# EasyEDA Pro project ProPrj_cap banks_2026-02-15.epro, schematic Schematic1
Board Name: Board1; Create Date: 2025-07-01; Page Name: P1; Project Name: cap bank; Schematic Name: Schematic1; Update Date: 2025-08-10; Company: EasyEDA.com; Page Size: A4; Version: V1.0
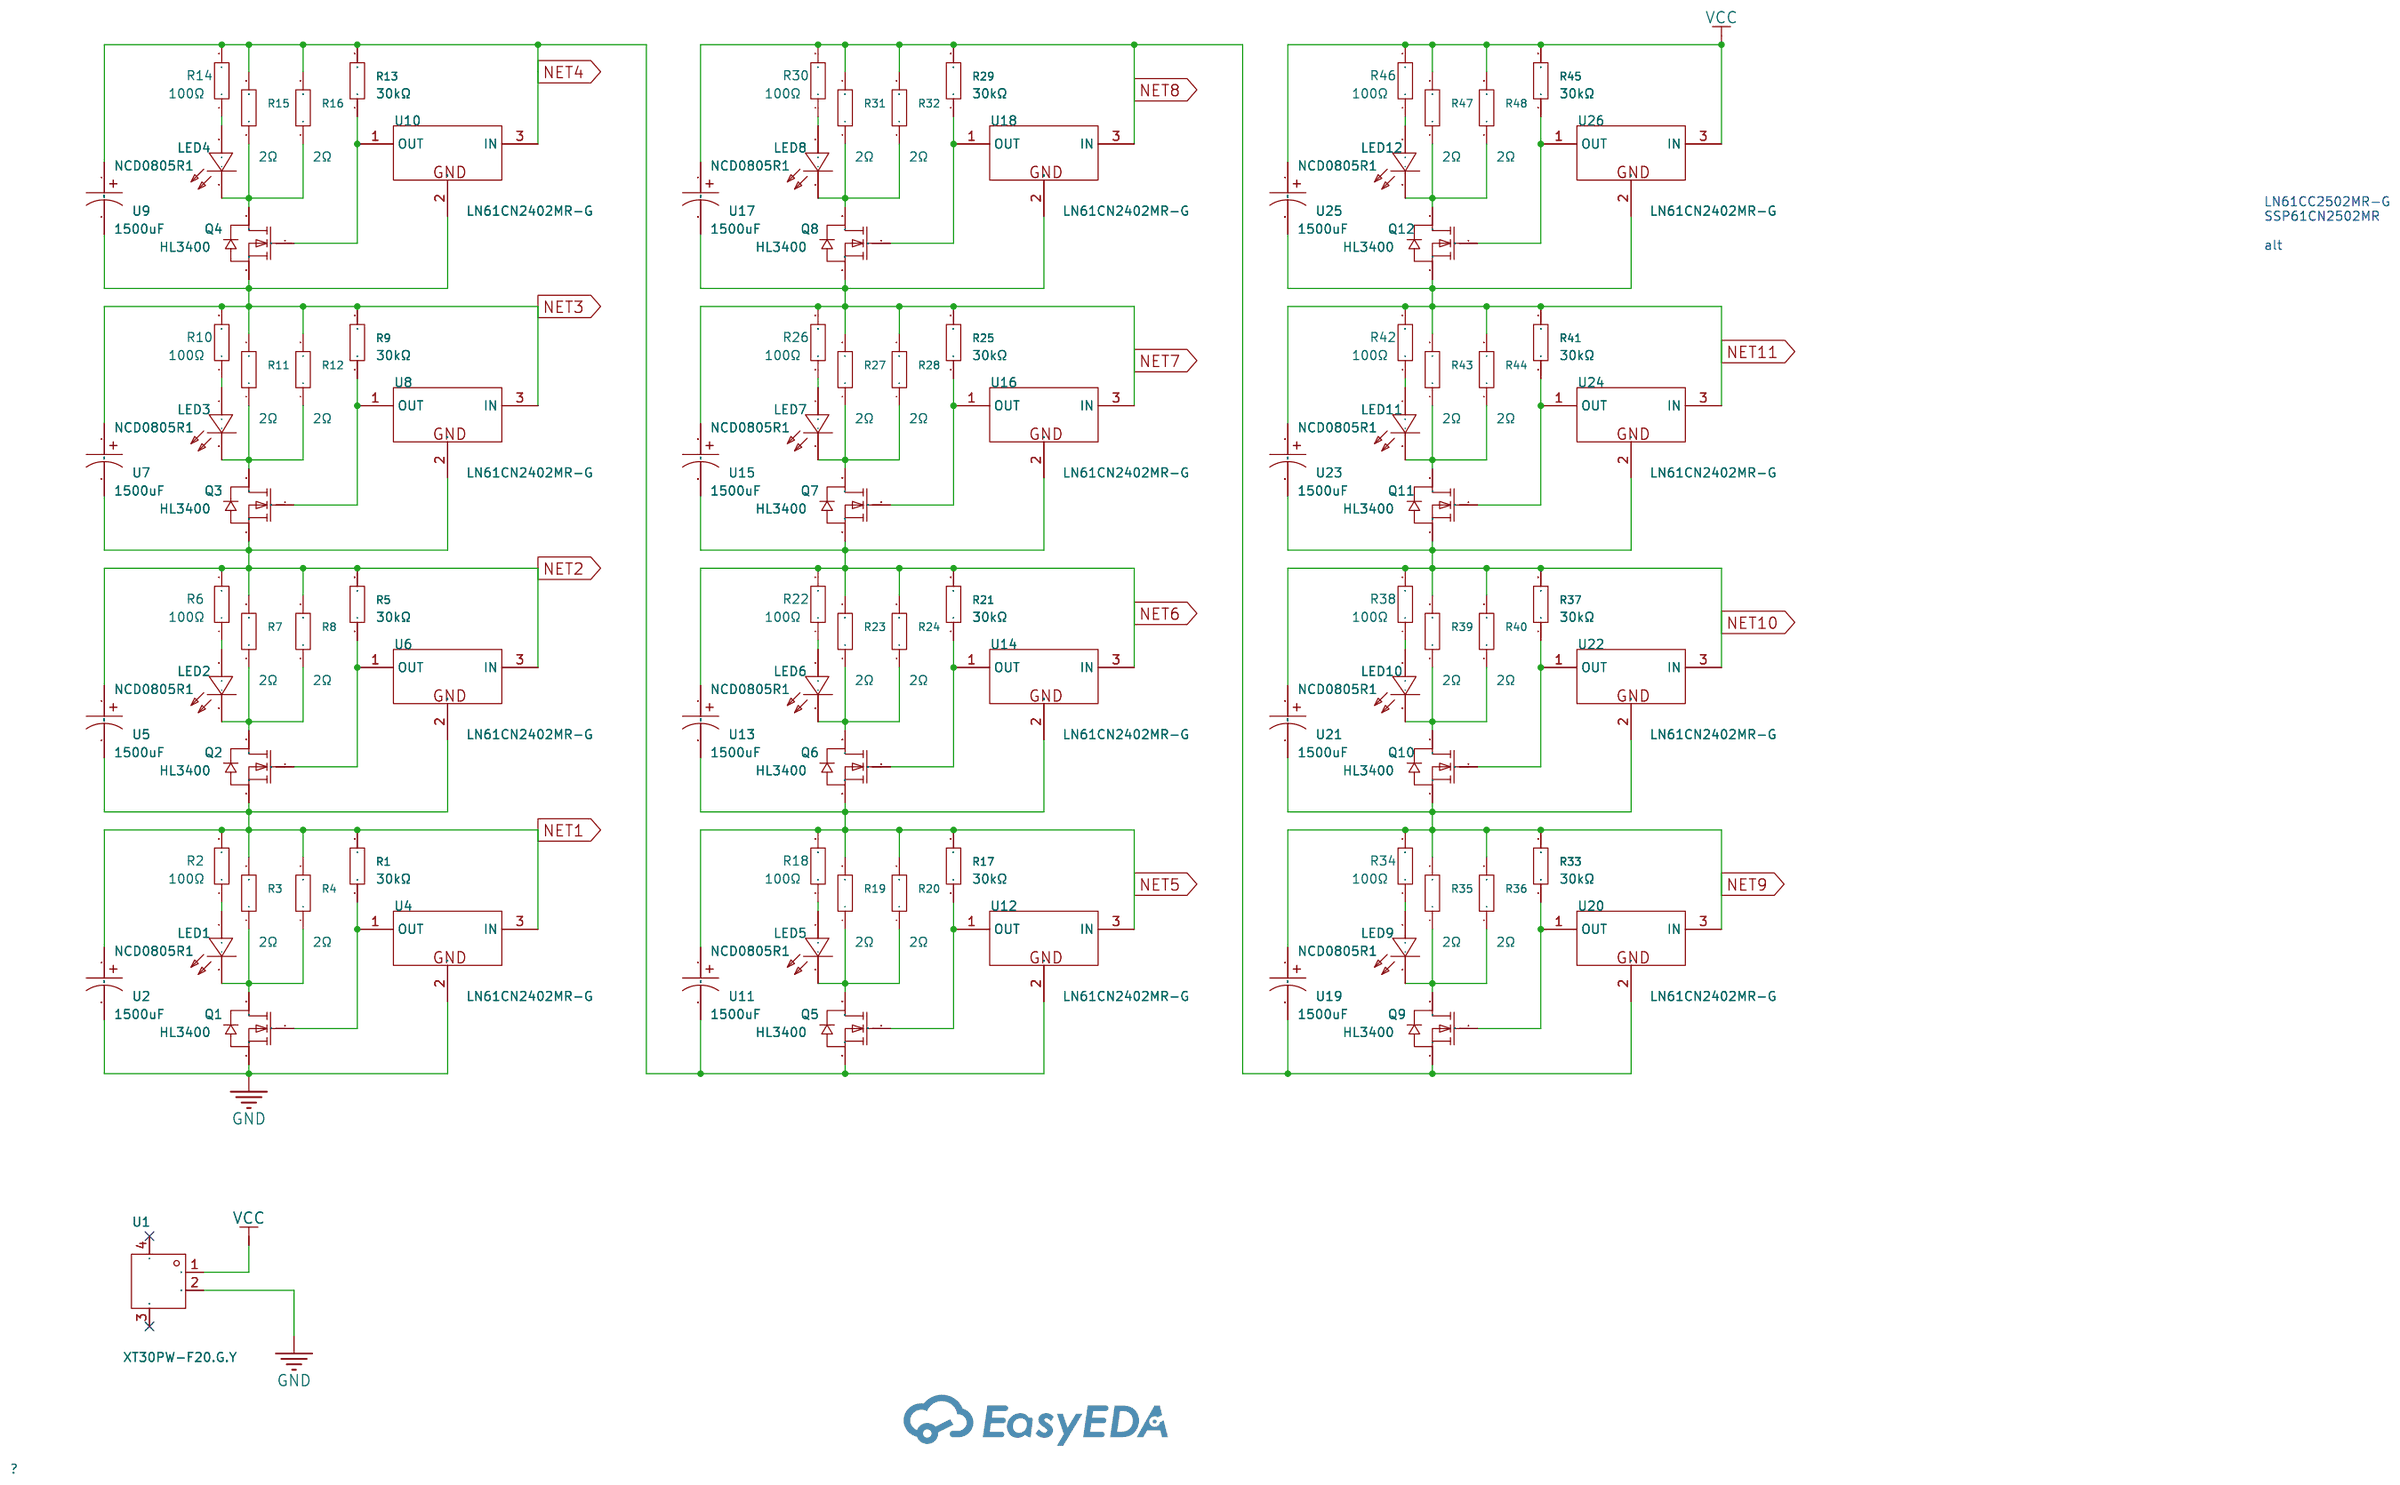
[diagram p0: schematic sheet]

## Parts
LED1  NCD0805R1  [LED0805-R-RD]
LED2  NCD0805R1  [LED0805-R-RD]
LED3  NCD0805R1  [LED0805-R-RD]
LED4  NCD0805R1  [LED0805-R-RD]
LED5  NCD0805R1  [LED0805-R-RD]
LED6  NCD0805R1  [LED0805-R-RD]
LED7  NCD0805R1  [LED0805-R-RD]
LED8  NCD0805R1  [LED0805-R-RD]
LED9  NCD0805R1  [LED0805-R-RD]
LED10  NCD0805R1  [LED0805-R-RD]
LED11  NCD0805R1  [LED0805-R-RD]
LED12  NCD0805R1  [LED0805-R-RD]
Q1  HL3400  [SOT-23-3_L2.9-W1.3-P1.90-LS2.4-BR]
Q2  HL3400  [SOT-23-3_L2.9-W1.3-P1.90-LS2.4-BR]
Q3  HL3400  [SOT-23-3_L2.9-W1.3-P1.90-LS2.4-BR]
Q4  HL3400  [SOT-23-3_L2.9-W1.3-P1.90-LS2.4-BR]
Q5  HL3400  [SOT-23-3_L2.9-W1.3-P1.90-LS2.4-BR]
Q6  HL3400  [SOT-23-3_L2.9-W1.3-P1.90-LS2.4-BR]
Q7  HL3400  [SOT-23-3_L2.9-W1.3-P1.90-LS2.4-BR]
Q8  HL3400  [SOT-23-3_L2.9-W1.3-P1.90-LS2.4-BR]
Q9  HL3400  [SOT-23-3_L2.9-W1.3-P1.90-LS2.4-BR]
Q10  HL3400  [SOT-23-3_L2.9-W1.3-P1.90-LS2.4-BR]
Q11  HL3400  [SOT-23-3_L2.9-W1.3-P1.90-LS2.4-BR]
Q12  HL3400  [SOT-23-3_L2.9-W1.3-P1.90-LS2.4-BR]
R1  30kΩ  [R0805]
R2  100Ω  [R0805]
R3  2Ω  [R2512]
R4  2Ω  [R2512]
R5  30kΩ  [R0805]
R6  100Ω  [R0805]
R7  2Ω  [R2512]
R8  2Ω  [R2512]
R9  30kΩ  [R0805]
R10  100Ω  [R0805]
R11  2Ω  [R2512]
R12  2Ω  [R2512]
R13  30kΩ  [R0805]
R14  100Ω  [R0805]
R15  2Ω  [R2512]
R16  2Ω  [R2512]
R17  30kΩ  [R0805]
R18  100Ω  [R0805]
R19  2Ω  [R2512]
R20  2Ω  [R2512]
R21  30kΩ  [R0805]
R22  100Ω  [R0805]
R23  2Ω  [R2512]
R24  2Ω  [R2512]
R25  30kΩ  [R0805]
R26  100Ω  [R0805]
R27  2Ω  [R2512]
R28  2Ω  [R2512]
R29  30kΩ  [R0805]
R30  100Ω  [R0805]
R31  2Ω  [R2512]
R32  2Ω  [R2512]
R33  30kΩ  [R0805]
R34  100Ω  [R0805]
R35  2Ω  [R2512]
R36  2Ω  [R2512]
R37  30kΩ  [R0805]
R38  100Ω  [R0805]
R39  2Ω  [R2512]
R40  2Ω  [R2512]
R41  30kΩ  [R0805]
R42  100Ω  [R0805]
R43  2Ω  [R2512]
R44  2Ω  [R2512]
R45  30kΩ  [R0805]
R46  100Ω  [R0805]
R47  2Ω  [R2512]
R48  2Ω  [R2512]
U1  XT30PW-F20.G.Y  [CONN-TH_XT30PW-F-1]
U2  1500uF  [CAP-TH_BD18.0-P7.50-D0.8-FD]
U4  LN61CN2402MR-G  [SOT-23_L2.9-W1.3-P1.90-LS2.4-BR]
U5  1500uF  [CAP-TH_BD18.0-P7.50-D0.8-FD]
U6  LN61CN2402MR-G  [SOT-23_L2.9-W1.3-P1.90-LS2.4-BR]
U7  1500uF  [CAP-TH_BD18.0-P7.50-D0.8-FD]
U8  LN61CN2402MR-G  [SOT-23_L2.9-W1.3-P1.90-LS2.4-BR]
U9  1500uF  [CAP-TH_BD18.0-P7.50-D0.8-FD]
U10  LN61CN2402MR-G  [SOT-23_L2.9-W1.3-P1.90-LS2.4-BR]
U11  1500uF  [CAP-TH_BD18.0-P7.50-D0.8-FD]
U12  LN61CN2402MR-G  [SOT-23_L2.9-W1.3-P1.90-LS2.4-BR]
U13  1500uF  [CAP-TH_BD18.0-P7.50-D0.8-FD]
U14  LN61CN2402MR-G  [SOT-23_L2.9-W1.3-P1.90-LS2.4-BR]
U15  1500uF  [CAP-TH_BD18.0-P7.50-D0.8-FD]
U16  LN61CN2402MR-G  [SOT-23_L2.9-W1.3-P1.90-LS2.4-BR]
U17  1500uF  [CAP-TH_BD18.0-P7.50-D0.8-FD]
U18  LN61CN2402MR-G  [SOT-23_L2.9-W1.3-P1.90-LS2.4-BR]
U19  1500uF  [CAP-TH_BD18.0-P7.50-D0.8-FD]
U20  LN61CN2402MR-G  [SOT-23_L2.9-W1.3-P1.90-LS2.4-BR]
U21  1500uF  [CAP-TH_BD18.0-P7.50-D0.8-FD]
U22  LN61CN2402MR-G  [SOT-23_L2.9-W1.3-P1.90-LS2.4-BR]
U23  1500uF  [CAP-TH_BD18.0-P7.50-D0.8-FD]
U24  LN61CN2402MR-G  [SOT-23_L2.9-W1.3-P1.90-LS2.4-BR]
U25  1500uF  [CAP-TH_BD18.0-P7.50-D0.8-FD]
U26  LN61CN2402MR-G  [SOT-23_L2.9-W1.3-P1.90-LS2.4-BR]

## Library data of the parts
LED1-LED12 = NCD0805R1_C84256: Lamp Holder Type:- Emitted Color:Red Forward Voltage (VF):1.6V~2.6V Forward Voltage (VF):1.6V~2.6V Power Dissipation:65mW Forward Current:20mA Dominant Wavelength:615nm~630nm Dominant Wavelength:615nm~630nm Peak Wavelength:- Diode Configuration:独立二极管 Lens; Supplier Part: C84256; Manufacturer: 国星光电; Supplier Footprint: 0805; JLCPCB Part Class: Basic Part; Datasheet: https://atta.szlcsc.com/upload/public/pdf/source/20200820/C84256_F0A75A43B3EAD75808600A0514C76B99.pdf; Supplier: LCSC; Emitted Color: Red; Forward Voltage (VF): 1.6V~2.6V; Power Dissipation: 65mW; Forward Current: 20mA; Dominant Wavelength: 615nm~630nm; Diode Configuration: 独立二极管; Lens Color: 无色透明透镜; Luminous Intensity: 67mcd~195mcd; Viewing Angle: 130°; Operating Temperature: -30℃~+85℃
Q1-Q12 = HL3400: Type:1 N-channel Drain to Source Voltage:30V Current - Continuous Drain(Id):5.6A RDS(on):33mΩ@4.5V,5A Pd - Power Dissipation:1.2W Gate Threshold Voltage (Vgs(th)@Id):1.5V Gate Charge(Qg):17nC@4.5V Input Capacitance(Ciss@Vds):630pF@15V Reverse Transfer Cap; LCSC Part Name: N-通道,电流:5.6A,耐压:30V; Supplier Part: C22469448; Manufacturer: 宏嘉诚; Supplier Footprint: SOT-23; JLCPCB Part Class: Extended Part; Datasheet: https://atta.szlcsc.com/upload/public/pdf/source/20250106/821A5FA5B3A156C0B96C3BD3FAAD026C.pdf; Supplier: LCSC; Type: 1 N-channel; Drain to Source Voltage: 30V; Current - Continuous Drain(Id): 5.6A; RDS(on): 33mΩ@4.5V,5A; Pd - Power Dissipation: 1.2W; Gate Threshold Voltage (Vgs(th)@Id): 1.5V; Gate Charge(Qg): 17nC@4.5V; Input Capacitance(Ciss@Vds): 630pF@15V; Reverse Transfer Capacitance (Crss@Vds): 71pF@15V; Operating Temperature: -55℃~+150℃
R1 R5 R9 R13 R17 R21 R25 R29 R33 R37 R41 R45 = 0805W8F3002T5E: Type:Thick Film Resistors Resistance:30kΩ Tolerance:±1% Tolerance:±1% Power(Watts): Overload Voltage (Max): Temperature Coefficient:±100ppm/℃ Temperature Coefficient:±100ppm/℃ Operating Temperature Range:-55℃~+155℃ Operating Temperature Range:-55℃~+155℃; LCSC Part Name: 30kΩ ±1% 125mW 厚膜电阻; Supplier Part: C17621; Manufacturer: UNI-ROYAL(厚声); Supplier Footprint: 0805; JLCPCB Part Class: Basic Part; Datasheet: https://atta.szlcsc.com/upload/public/pdf/source/20200306/C422600_1E6D84923E4A46A82E41ADD87F860B5C.pdf; Supplier: LCSC; Type: Thick Film Resistors; Tolerance: ±1%; Temperature Coefficient: ±100ppm/℃; Operating Temperature Range: -55℃~+155℃
R2 R6 R10 R14 R18 R22 R26 R30 R34 R38 R42 R46 = 0805W8F1000T5E_C17408: Type:Thick Film Resistors Resistance: Tolerance:±1% Tolerance:±1% Power(Watts): Overload Voltage (Max): Temperature Coefficient:±100ppm/℃ Temperature Coefficient:±100ppm/℃ Operating Temperature Range:-55℃~+155℃ Operating Temperature Range:-55℃~+155℃; LCSC Part Name: 100Ω ±1% 125mW 厚膜电阻; Supplier Part: C17408; Manufacturer: UNI-ROYAL(厚声); Manufacturer Part: 0805W8F1000T5E; Supplier Footprint: 0805; JLCPCB Part Class: Basic Part; Datasheet: https://atta.szlcsc.com/upload/public/pdf/source/20200306/C422600_1E6D84923E4A46A82E41ADD87F860B5C.pdf; Supplier: LCSC; Type: Thick Film Resistors; Tolerance: ±1%; Temperature Coefficient: ±100ppm/℃; Operating Temperature Range: -55℃~+155℃
R3 R4 R7 R8 R11 R12 R15 R16 R19 R20 R23 R24 R27 R28 R31 R32 R35 R36 R39 R40 R43 R44 R47 R48 = FRC2512J2R0TS: Type:Thick Film Resistors Resistance:2Ω Tolerance:±5% Tolerance:±5% Power(Watts):1W Voltage-Supply(Max):200V Temperature Coefficient:±200ppm/℃ Temperature Coefficient:±200ppm/℃; LCSC Part Name: 2Ω ±5% 1W 厚膜电阻; Supplier Part: C3000637; Manufacturer: FOJAN(富捷); Supplier Footprint: 2512; JLCPCB Part Class: Extended Part; Datasheet: https://atta.szlcsc.com/upload/public/pdf/source/20211221/925EC7D7225764EE0046F22065062C87.pdf; Supplier: LCSC; Type: Thick Film Resistors; Tolerance: ±5%; Power(Watts): 1W; Voltage-Supply(Max): 200V; Temperature Coefficient: ±200ppm/℃
U1 = XT30PW-F20.G.Y: Power:- Output:- Input:- Size:- Interface:- Type:- Colour:- MaximumCurrent:- Type:航模插头 RatedVoltage:- Type1:- NumberOfUSBHoles:- InterfaceType:母头 MetalMaterial:- InsulationMaterial:- RatedCurrent:- RecommendedWireGauge:- FlameRetardantGrade:- contact resi; LCSC Part Name: AMASS(艾迈斯)电源连接器 母头 XT30PW-F; Supplier Part: C2913282; Manufacturer: AMASS(艾迈斯); JLCPCB Part Class: Extended Part; Datasheet: https://atta.szlcsc.com/upload/public/pdf/source/20231218/06CFCF98887A9A87638B0856A725C8FD.pdf; Supplier: LCSC; Type: 航模插头; InterfaceType: 母头
U2 U5 U7 U9 U11 U13 U15 U17 U19 U21 U23 U25 = 80ZLH1500MEFC18X40: Capacitance: Tolerance:±20% Tolerance:±20% Rated Voltage: Ripple Current:- Equivalent Series Resistance(ESR):- Lead Spacing:7.5mm φD: L: Lifetime @ Temp:- Operating Temperature:-40℃~+105℃ Operating Temperature:-40℃~+105℃; LCSC Part Name: 1500uF ±20% 80V; Supplier Part: C700879; Manufacturer: rubycon(红宝石); Supplier Footprint: 插件,D18xL40mm; JLCPCB Part Class: Extended Part; Datasheet: https://atta.szlcsc.com/upload/public/pdf/source/20200710/C700879_22A88F1D2FB7159B35BD93EA845084AE.pdf; Supplier: LCSC; Tolerance: ±20%; Lead Spacing: 7.5mm; Operating Temperature: -40℃~+105℃
U4 U6 U8 U10 U12 U14 U16 U18 U20 U22 U24 U26 = LN61CN2402MR-G: Supplier Part: C141418; Manufacturer: natlinear(南麟); Supplier Footprint: SOT-23; JLCPCB Part Class: Extended Part; Datasheet: https://atta.szlcsc.com/upload/public/pdf/source/20171110/C141418_15102792347801104211.pdf; Supplier: LCSC

## Nets
GND: Q1.2(S) U1.2 U2.2 U4.2(GND)
VCC: R45.2 R46.2 R47.2 R48.2 U1.1 U25.1 U26.3(IN)
NET1: Q2.2(S) R1.2 R2.2 R3.2 R4.2 U2.1 U4.3(IN) U5.2 U6.2(GND)
NET2: Q3.2(S) R5.2 R6.2 R7.2 R8.2 U5.1 U6.3(IN) U7.2 U8.2(GND)
NET3: Q4.2(S) R9.2 R10.2 R11.2 R12.2 U7.1 U8.3(IN) U9.2 U10.2(GND)
NET4: Q5.2(S) R13.2 R14.2 R15.2 R16.2 U9.1 U10.3(IN) U11.2 U12.2(GND)
NET5: Q6.2(S) R17.2 R18.2 R19.2 R20.2 U11.1 U12.3(IN) U13.2 U14.2(GND)
NET6: Q7.2(S) R21.2 R22.2 R23.2 R24.2 U13.1 U14.3(IN) U15.2 U16.2(GND)
NET7: Q8.2(S) R25.2 R26.2 R27.2 R28.2 U15.1 U16.3(IN) U17.2 U18.2(GND)
NET8: Q9.2(S) R29.2 R30.2 R31.2 R32.2 U17.1 U18.3(IN) U19.2 U20.2(GND)
NET9: Q10.2(S) R33.2 R34.2 R35.2 R36.2 U19.1 U20.3(IN) U21.2 U22.2(GND)
NET10: Q11.2(S) R37.2 R38.2 R39.2 R40.2 U21.1 U22.3(IN) U23.2 U24.2(GND)
NET11: Q12.2(S) R41.2 R42.2 R43.2 R44.2 U23.1 U24.3(IN) U25.2 U26.2(GND)
$1N471: LED1.1(+) R2.1
$1N732: LED1.2(-) Q1.3(D) R3.1 R4.1
$1N777: Q1.1(G) R1.1 U4.1(OUT)
$1N2020: LED2.1(+) R6.1
$1N2021: LED2.2(-) Q2.3(D) R7.1 R8.1
$1N2022: Q2.1(G) R5.1 U6.1(OUT)
$1N2372: LED3.1(+) R10.1
$1N2373: LED3.2(-) Q3.3(D) R11.1 R12.1
$1N2374: Q3.1(G) R9.1 U8.1(OUT)
$1N2721: LED4.1(+) R14.1
$1N2722: LED4.2(-) Q4.3(D) R15.1 R16.1
$1N2723: Q4.1(G) R13.1 U10.1(OUT)
$1N3070: LED5.1(+) R18.1
$1N3071: LED5.2(-) Q5.3(D) R19.1 R20.1
$1N3072: Q5.1(G) R17.1 U12.1(OUT)
$1N3398: LED6.1(+) R22.1
$1N3399: LED6.2(-) Q6.3(D) R23.1 R24.1
$1N3400: Q6.1(G) R21.1 U14.1(OUT)
$1N3726: LED7.1(+) R26.1
$1N3727: LED7.2(-) Q7.3(D) R27.1 R28.1
$1N3728: Q7.1(G) R25.1 U16.1(OUT)
$1N4054: LED8.1(+) R30.1
$1N4055: LED8.2(-) Q8.3(D) R31.1 R32.1
$1N4056: Q8.1(G) R29.1 U18.1(OUT)
$1N4382: LED9.1(+) R34.1
$1N4383: LED9.2(-) Q9.3(D) R35.1 R36.1
$1N4384: Q9.1(G) R33.1 U20.1(OUT)
$1N4710: LED10.1(+) R38.1
$1N4711: LED10.2(-) Q10.3(D) R39.1 R40.1
$1N4712: Q10.1(G) R37.1 U22.1(OUT)
$1N5038: LED11.1(+) R42.1
$1N5039: LED11.2(-) Q11.3(D) R43.1 R44.1
$1N5040: Q11.1(G) R41.1 U24.1(OUT)
$1N5366: LED12.1(+) R46.1
$1N5367: LED12.2(-) Q12.3(D) R47.1 R48.1
$1N5368: Q12.1(G) R45.1 U26.1(OUT)

Not connected (* = marked no-connect by the designer): U1 3* 4*

## Notes on the sheet
- LN61CC2502MR-G
  SSP61CN2502MR
  alt
